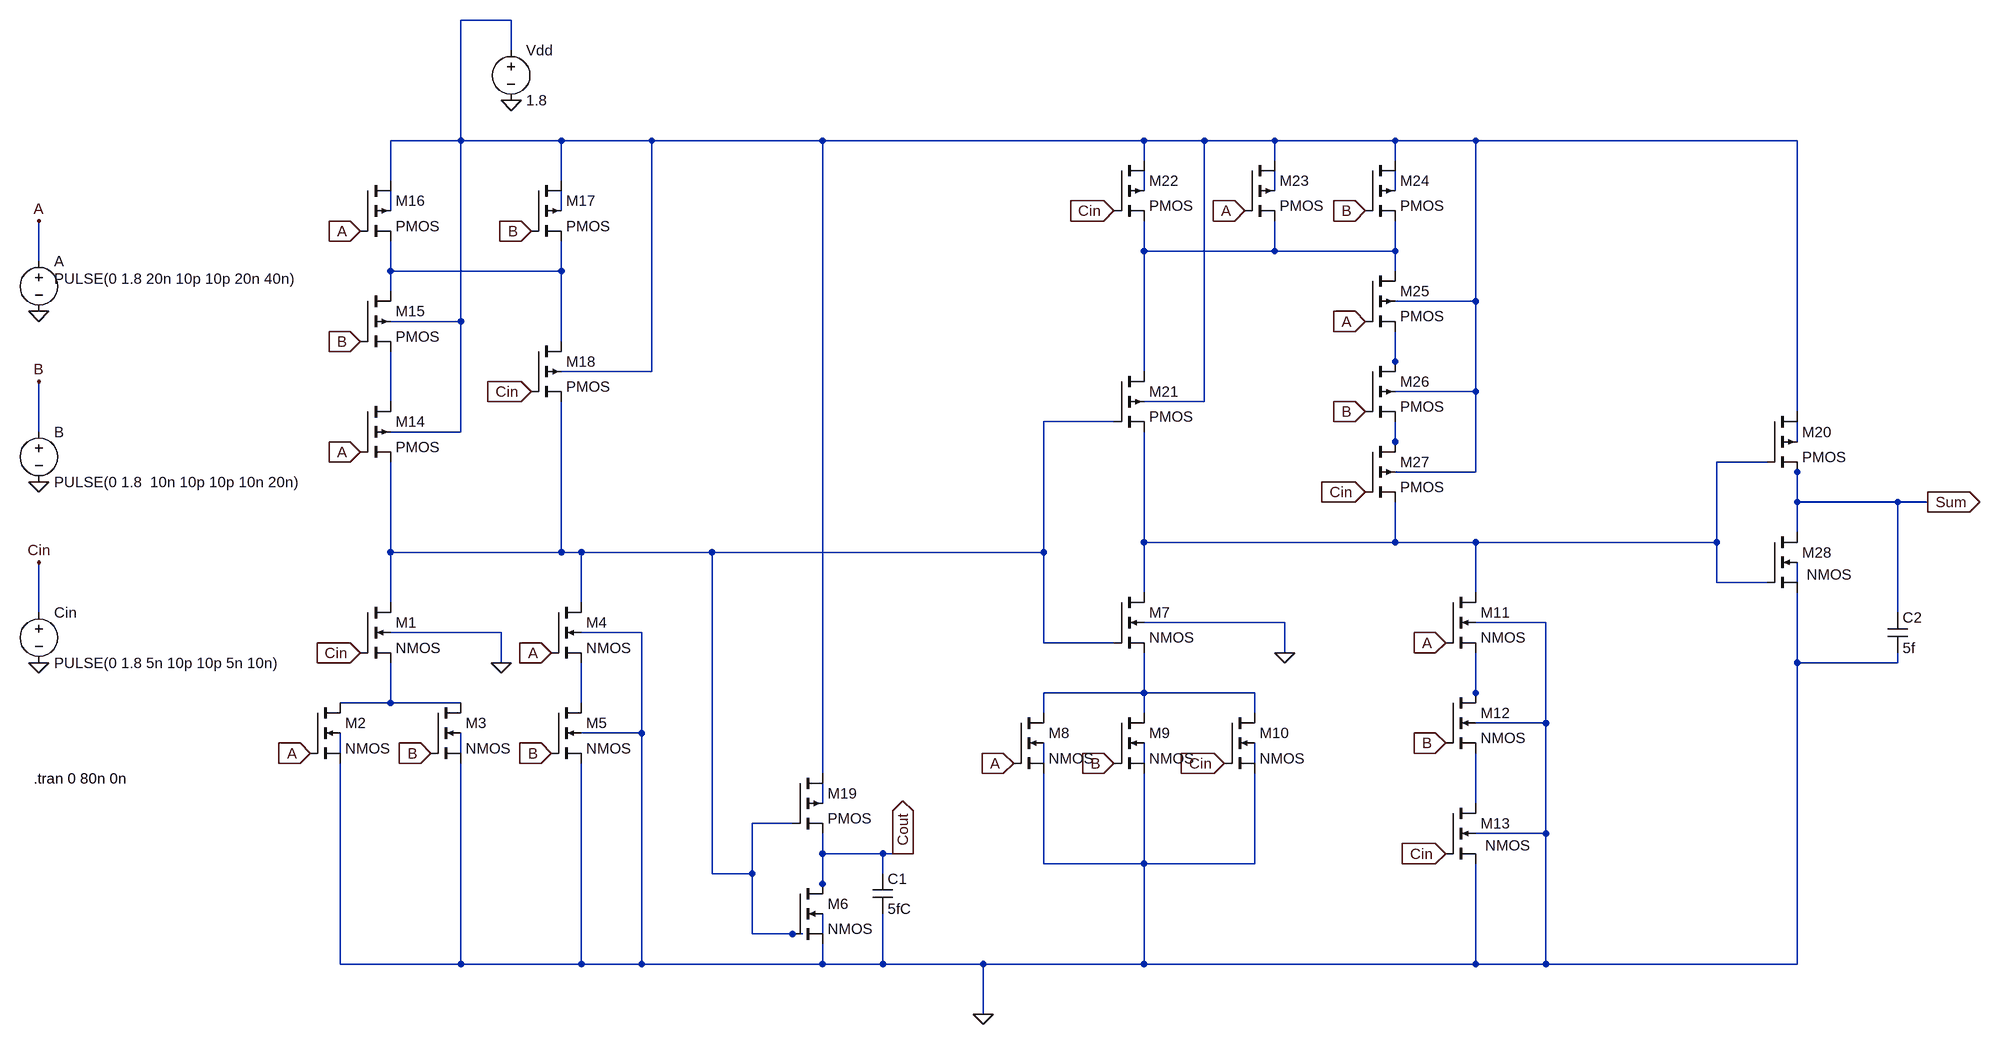
[diagram p0: schematic Sum.asc]
Sum.asc, the LTspice schematic file:
Version 4.1
SHEET 1 2484 1000
WIRE 80 -784 0 -784
WIRE 80 -736 80 -784
WIRE 0 -592 0 -784
WIRE 0 -592 -112 -592
WIRE 160 -592 0 -592
WIRE 304 -592 160 -592
WIRE 576 -592 304 -592
WIRE 1088 -592 576 -592
WIRE 1184 -592 1088 -592
WIRE 1296 -592 1184 -592
WIRE 1488 -592 1296 -592
WIRE 1616 -592 1488 -592
WIRE 2128 -592 1616 -592
WIRE 1088 -560 1088 -592
WIRE 1296 -560 1296 -592
WIRE 1488 -560 1488 -592
WIRE -112 -528 -112 -592
WIRE 160 -528 160 -592
WIRE 1088 -512 1088 -544
WIRE 1296 -512 1296 -544
WIRE 1488 -512 1488 -544
WIRE -112 -480 -112 -512
WIRE 160 -480 160 -512
WIRE 1088 -416 1088 -464
WIRE 1296 -416 1296 -464
WIRE 1296 -416 1088 -416
WIRE 1488 -416 1488 -464
WIRE 1488 -416 1296 -416
WIRE -672 -400 -672 -464
WIRE -112 -384 -112 -432
WIRE 160 -384 160 -432
WIRE 160 -384 -112 -384
WIRE 1488 -384 1488 -416
WIRE -112 -352 -112 -384
WIRE 1616 -336 1616 -592
WIRE 1616 -336 1488 -336
WIRE 0 -304 0 -592
WIRE 0 -304 -112 -304
WIRE 160 -272 160 -384
WIRE 1488 -240 1488 -288
WIRE 304 -224 304 -592
WIRE 304 -224 160 -224
WIRE 1088 -224 1088 -416
WIRE 1488 -224 1488 -240
WIRE 1616 -192 1616 -336
WIRE 1616 -192 1488 -192
WIRE -112 -176 -112 -256
WIRE 1184 -176 1184 -592
WIRE 1184 -176 1088 -176
WIRE 2128 -160 2128 -592
WIRE 1040 -144 928 -144
WIRE -672 -128 -672 -208
WIRE 0 -128 0 -304
WIRE 0 -128 -112 -128
WIRE 1488 -112 1488 -144
WIRE 2128 -112 2128 -144
WIRE 1488 -96 1488 -112
WIRE 2080 -80 2000 -80
WIRE 1616 -64 1616 -192
WIRE 1616 -64 1488 -64
WIRE 2128 -64 2128 -80
WIRE 2128 -16 2128 -64
WIRE 2288 -16 2128 -16
WIRE 2336 -16 2288 -16
WIRE 2128 32 2128 -16
WIRE 1088 48 1088 -128
WIRE 1488 48 1488 -16
WIRE 1488 48 1088 48
WIRE 1616 48 1488 48
WIRE 2000 48 2000 -80
WIRE 2000 48 1616 48
WIRE -112 64 -112 -80
WIRE 160 64 160 -176
WIRE 160 64 -112 64
WIRE 192 64 160 64
WIRE 400 64 192 64
WIRE 928 64 928 -144
WIRE 928 64 400 64
WIRE 2000 112 2000 48
WIRE 2080 112 2000 112
WIRE 2128 112 2128 80
WIRE 1088 128 1088 48
WIRE 1616 128 1616 48
WIRE -112 144 -112 64
WIRE 192 144 192 64
WIRE -672 160 -672 80
WIRE 2288 160 2288 -16
WIRE 1312 176 1088 176
WIRE 1728 176 1616 176
WIRE 64 192 -112 192
WIRE 288 192 192 192
WIRE 928 208 928 64
WIRE 1040 208 928 208
WIRE 1312 224 1312 176
WIRE 64 240 64 192
WIRE 2128 240 2128 128
WIRE 2288 240 2288 224
WIRE 2288 240 2128 240
WIRE 1088 288 1088 224
WIRE 1088 288 928 288
WIRE 1264 288 1088 288
WIRE 1616 288 1616 224
WIRE -112 304 -112 240
WIRE -112 304 -192 304
WIRE 0 304 -112 304
WIRE 192 304 192 240
WIRE 1616 304 1616 288
WIRE 928 320 928 288
WIRE 1088 320 1088 288
WIRE 1264 320 1264 288
WIRE 1728 336 1728 176
WIRE 1728 336 1616 336
WIRE 288 352 288 192
WIRE 288 352 192 352
WIRE -192 384 -192 352
WIRE 0 384 0 352
WIRE 928 400 928 368
WIRE 1088 400 1088 368
WIRE 1264 400 1264 368
WIRE 576 416 576 -592
WIRE 576 464 576 432
WIRE 1616 464 1616 384
WIRE 528 496 464 496
WIRE 1728 512 1728 336
WIRE 1728 512 1616 512
WIRE 576 544 576 512
WIRE 672 544 576 544
WIRE 704 544 672 544
WIRE 720 544 704 544
WIRE 928 560 928 416
WIRE 1088 560 1088 416
WIRE 1088 560 928 560
WIRE 1264 560 1264 416
WIRE 1264 560 1088 560
WIRE 400 576 400 64
WIRE 464 576 464 496
WIRE 464 576 400 576
WIRE 672 576 672 544
WIRE 576 592 576 544
WIRE 576 608 576 592
WIRE 464 672 464 576
WIRE 528 672 464 672
WIRE 544 672 528 672
WIRE 576 672 576 640
WIRE -192 720 -192 400
WIRE 0 720 0 400
WIRE 0 720 -192 720
WIRE 192 720 192 400
WIRE 192 720 0 720
WIRE 288 720 288 352
WIRE 288 720 192 720
WIRE 576 720 576 688
WIRE 576 720 288 720
WIRE 672 720 672 640
WIRE 672 720 576 720
WIRE 832 720 672 720
WIRE 1088 720 1088 560
WIRE 1088 720 832 720
WIRE 1616 720 1616 560
WIRE 1616 720 1088 720
WIRE 1728 720 1728 512
WIRE 1728 720 1616 720
WIRE 2128 720 2128 240
WIRE 2128 720 1728 720
WIRE 832 800 832 720
FLAG -160 224 Cin
IOPIN -160 224 In
FLAG 112 -192 Cin
IOPIN 112 -192 In
FLAG 1216 400 Cin
IOPIN 1216 400 In
FLAG 1040 -480 Cin
IOPIN 1040 -480 In
FLAG 1440 -32 Cin
IOPIN 1440 -32 In
FLAG 1568 544 Cin
IOPIN 1568 544 In
FLAG -240 384 A
IOPIN -240 384 In
FLAG -160 -448 A
IOPIN -160 -448 In
FLAG -160 -96 A
IOPIN -160 -96 In
FLAG 144 224 A
IOPIN 144 224 In
FLAG 880 400 A
IOPIN 880 400 In
FLAG 1568 208 A
IOPIN 1568 208 In
FLAG 1440 -304 A
IOPIN 1440 -304 In
FLAG 1248 -480 A
IOPIN 1248 -480 In
FLAG 112 -448 B
IOPIN 112 -448 In
FLAG -160 -272 B
IOPIN -160 -272 In
FLAG -48 384 B
IOPIN -48 384 In
FLAG 144 384 B
IOPIN 144 384 In
FLAG 1040 400 B
IOPIN 1040 400 In
FLAG 1440 -480 B
IOPIN 1440 -480 In
FLAG 1440 -160 B
IOPIN 1440 -160 In
FLAG 1568 368 B
IOPIN 1568 368 In
FLAG 704 544 Cout
IOPIN 704 544 Out
FLAG 2336 -16 Sum
IOPIN 2336 -16 Out
FLAG 80 -656 0
FLAG 832 800 0
FLAG 64 240 0
FLAG 1312 224 0
FLAG -672 -320 0
FLAG -672 -48 0
FLAG -672 240 0
FLAG -672 -464 A
FLAG -672 -208 B
FLAG -672 80 Cin
SYMBOL nmos4 -160 144 R0
SYMATTR InstName M1
SYMATTR Value2 l=180n w=800n
SYMBOL nmos4 -240 304 R0
SYMATTR InstName M2
SYMATTR Value2 l=180n w=800n
SYMBOL nmos4 -48 304 R0
SYMATTR InstName M3
SYMATTR Value2 l=180n w=800n
SYMBOL nmos4 144 144 R0
SYMATTR InstName M4
SYMATTR Value2 l=180n w=800n
SYMBOL nmos4 144 304 R0
SYMATTR InstName M5
SYMATTR Value2 l=180n w=800n
SYMBOL nmos4 528 592 R0
SYMATTR InstName M6
SYMATTR Value2 l=180n w=400n
SYMBOL nmos4 1040 128 R0
SYMATTR InstName M7
SYMATTR Value2 l=180n w=800n
SYMBOL nmos4 880 320 R0
SYMATTR InstName M8
SYMATTR Value2 l=180n w=800n
SYMBOL nmos4 1040 320 R0
SYMATTR InstName M9
SYMATTR Value2 l=180n w=800n
SYMBOL nmos4 1216 320 R0
SYMATTR InstName M10
SYMATTR Value2 l=180n w=800n
SYMBOL nmos4 1568 128 R0
SYMATTR InstName M11
SYMATTR Value2 l=180n w=1200n
SYMBOL nmos4 1568 288 R0
SYMATTR InstName M12
SYMATTR Value2 l=180n w=1200n
SYMBOL nmos4 1568 464 R0
WINDOW 3 63 67 Left 2
SYMATTR InstName M13
SYMATTR Value2 l=180n w=1200n
SYMBOL pmos4 -160 -176 R0
SYMATTR InstName M14
SYMATTR Value2 l=180n w=1600n
SYMBOL pmos4 -160 -352 R0
SYMATTR InstName M15
SYMATTR Value2 l=180n w=1600n
SYMBOL pmos4 -160 -528 R0
SYMATTR InstName M16
SYMATTR Value2 l=180n w=1600n
SYMBOL pmos4 112 -528 R0
SYMATTR InstName M17
SYMATTR Value2 l=180n w=1600n
SYMBOL pmos4 112 -272 R0
SYMATTR InstName M18
SYMATTR Value2 l=180n w=1600n
SYMBOL pmos4 528 416 R0
SYMATTR InstName M19
SYMATTR Value2 l=180n w=800n
SYMBOL pmos4 2080 -160 R0
SYMATTR InstName M20
SYMATTR Value2 l=180n w=800n
SYMBOL pmos4 1040 -224 R0
SYMATTR InstName M21
SYMATTR Value2 l=180n w=3200n
SYMBOL pmos4 1040 -560 R0
SYMATTR InstName M22
SYMATTR Value2 l=180n w=3200n
SYMBOL pmos4 1248 -560 R0
SYMATTR InstName M23
SYMATTR Value2 l=180n w=3200n
SYMBOL pmos4 1440 -560 R0
SYMATTR InstName M24
SYMATTR Value2 l=180n w=3200n
SYMBOL pmos4 1440 -384 R0
SYMATTR InstName M25
SYMATTR Value2 l=180n w=3200n
SYMBOL pmos4 1440 -240 R0
SYMATTR InstName M26
SYMATTR Value2 l=180n w=3200n
SYMBOL pmos4 1440 -112 R0
SYMATTR InstName M27
SYMATTR Value2 l=180n w=3200n
SYMBOL nmos4 2080 32 R0
WINDOW 3 63 67 Left 2
SYMATTR InstName M28
SYMATTR Value2 l=180n w=400n
SYMBOL voltage 80 -752 R0
WINDOW 123 0 0 Left 0
WINDOW 39 0 0 Left 0
SYMATTR InstName Vdd
SYMATTR Value 1.8
SYMBOL voltage -672 -416 R0
WINDOW 3 24 44 Left 2
WINDOW 123 0 0 Left 0
WINDOW 39 0 0 Left 0
SYMATTR Value PULSE(0 1.8 20n 10p 10p 20n 40n)
SYMATTR InstName A
SYMBOL voltage -672 -144 R0
WINDOW 123 0 0 Left 0
WINDOW 39 0 0 Left 0
SYMATTR InstName B
SYMATTR Value PULSE(0 1.8  10n 10p 10p 10n 20n)
SYMBOL voltage -672 144 R0
WINDOW 123 0 0 Left 0
WINDOW 39 0 0 Left 0
SYMATTR InstName Cin
SYMATTR Value PULSE(0 1.8 5n 10p 10p 5n 10n)
SYMBOL cap 656 576 R0
SYMATTR InstName C1
SYMATTR Value 5fC
SYMBOL cap 2272 160 R0
SYMATTR InstName C2
SYMATTR Value 5f
TEXT -680 424 Left 2 !.tran 0 80n 0n

The netlist it stands for:
* Sum.asc
M1 N011 Cin N018 0 NMOS l=180n w=800n
M2 N018 A 0 N020 NMOS l=180n w=800n
M3 N018 B 0 N021 NMOS l=180n w=800n
M4 N011 A N019 0 NMOS l=180n w=800n
M5 N019 B 0 0 NMOS l=180n w=800n
M6 Cout N011 0 N027 NMOS l=180n w=400n
M7 N014 N011 N016 0 NMOS l=180n w=800n
M8 N016 A 0 N022 NMOS l=180n w=800n
M9 N016 B 0 N023 NMOS l=180n w=800n
M10 N016 Cin 0 N024 NMOS l=180n w=800n
M11 N014 A N017 0 NMOS l=180n w=1200n
M12 N017 B N026 0 NMOS l=180n w=1200n
M13 N026 Cin 0 0 NMOS l=180n w=1200n
M14 N010 A N011 N001 PMOS l=180n w=1600n
M15 N008 B N010 N001 PMOS l=180n w=1600n
M16 N001 A N008 N005 PMOS l=180n w=1600n
M17 N001 B N008 N006 PMOS l=180n w=1600n
M18 N008 Cin N011 N001 PMOS l=180n w=1600n
M19 N001 N011 Cout N025 PMOS l=180n w=800n
M20 N001 N014 Sum N013 PMOS l=180n w=800n
M21 N007 N011 N014 N001 PMOS l=180n w=3200n
M22 N001 Cin N007 N002 PMOS l=180n w=3200n
M23 N001 A N007 N003 PMOS l=180n w=3200n
M24 N001 B N007 N004 PMOS l=180n w=3200n
M25 N007 A N009 N001 PMOS l=180n w=3200n
M26 N009 B N012 N001 PMOS l=180n w=3200n
M27 N012 Cin N014 N001 PMOS l=180n w=3200n
M28 Sum N014 0 N015 NMOS l=180n w=400n
Vdd N001 0 1.8
V§A A 0 PULSE(0 1.8 20n 10p 10p 20n 40n)
V§B B 0 PULSE(0 1.8  10n 10p 10p 10n 20n)
V§Cin Cin 0 PULSE(0 1.8 5n 10p 10p 5n 10n)
C1 Cout 0 5fC
C2 Sum 0 5f
.model NMOS NMOS
.model PMOS PMOS
.lib standard.mos
.tran 0 80n 0n
.backanno
.end